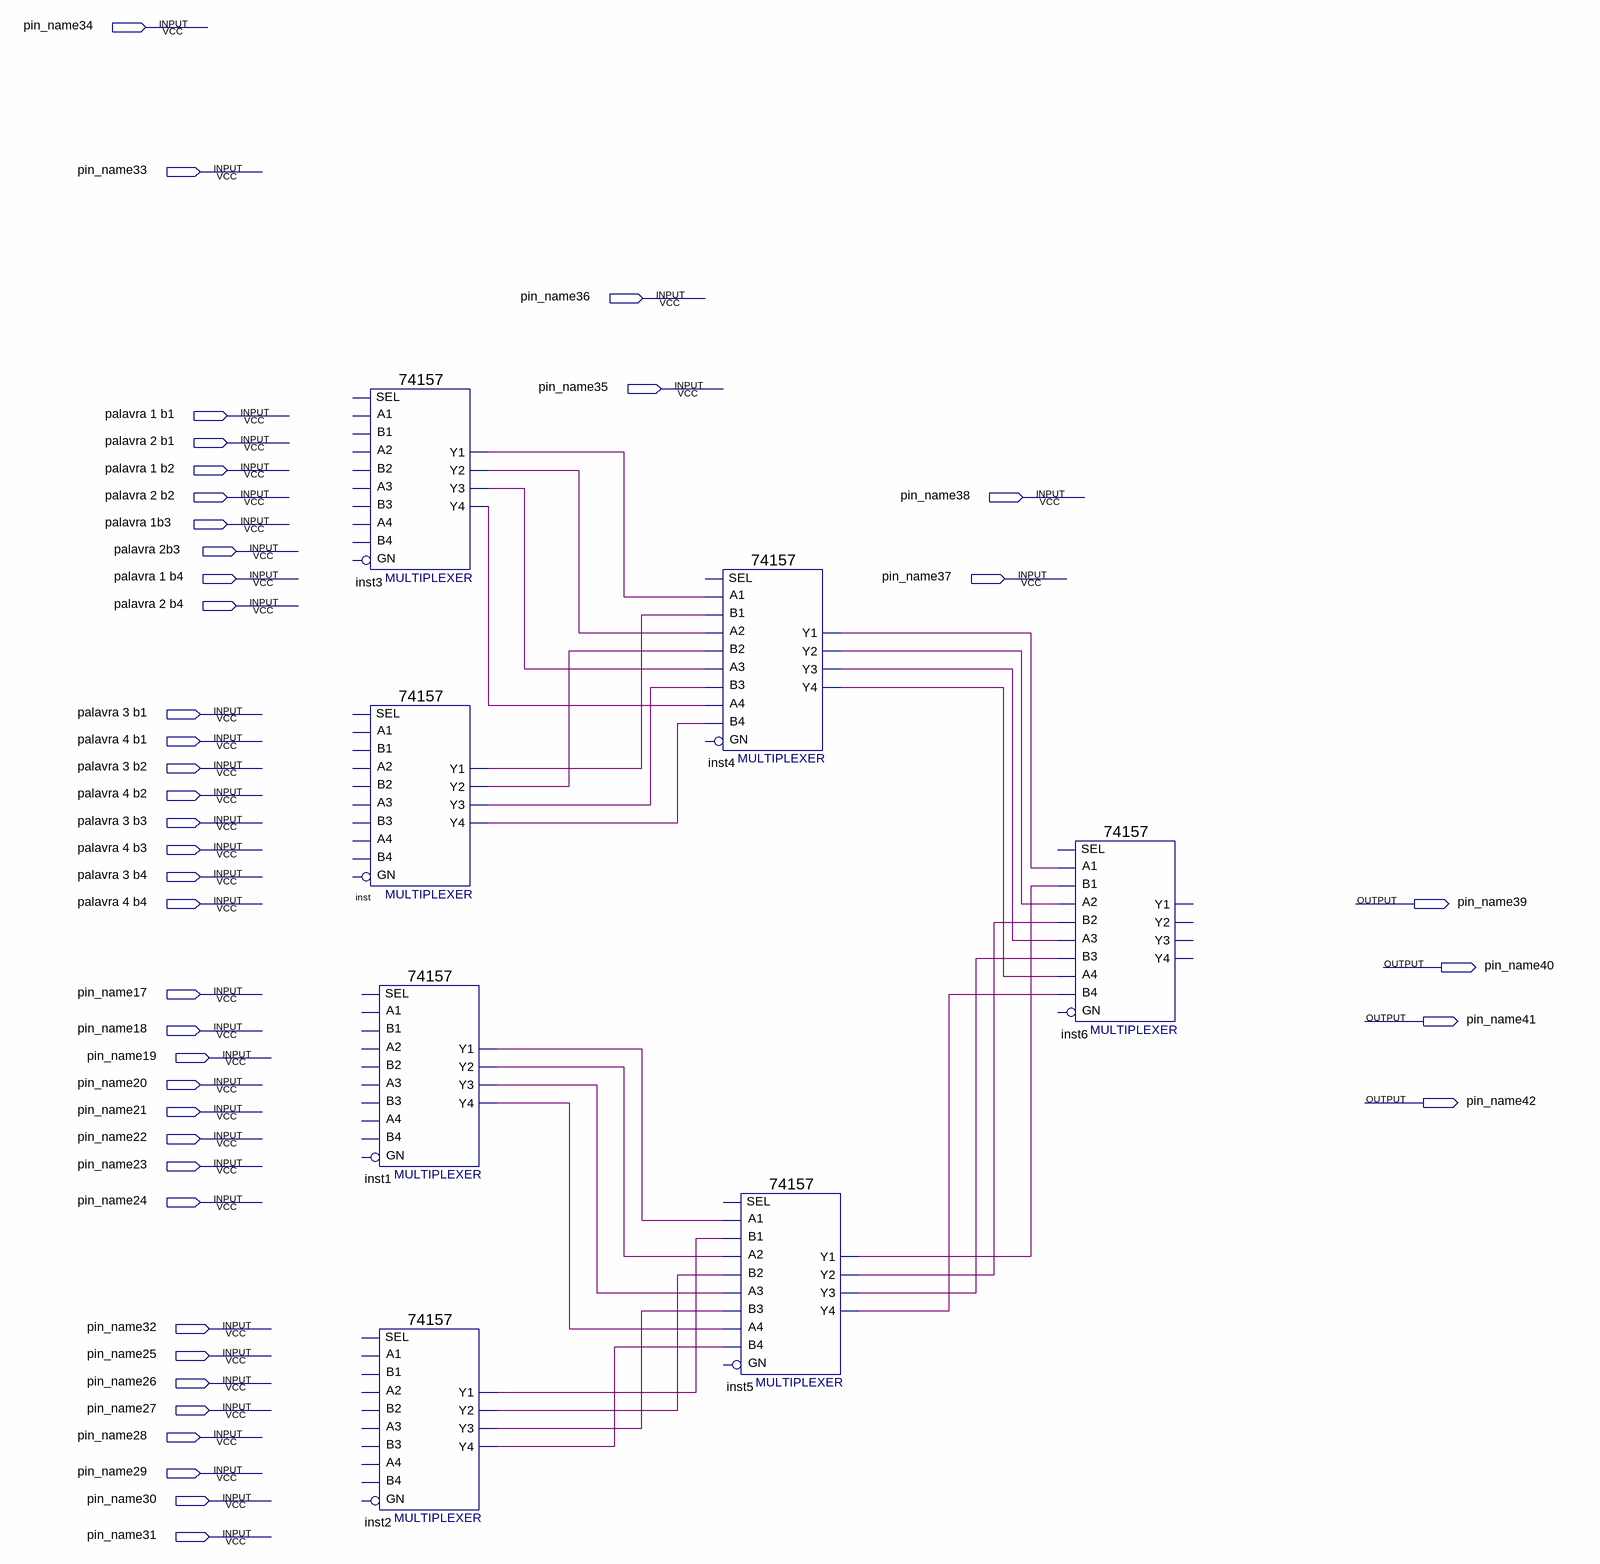
[diagram p0: schematic sheet]
// Quartus schematic Block2.bdf as structural Verilog: 7 symbols, 42 pins
module Block2 (
  input  pin_name34,
  input  pin_name33,
  input  pin_name36,
  input  pin_name35,
  input  \palavra_1_b1 ,
  input  \palavra_2_b1 ,
  input  \palavra_1_b2 ,
  input  \palavra_2_b2 ,
  input  pin_name38,
  input  \palavra_1b3 ,
  input  \palavra_2b3 ,
  input  \palavra_1_b4 ,
  input  pin_name37,
  input  \palavra_2_b4 ,
  input  \palavra_3_b1 ,
  input  \palavra_4_b1 ,
  input  \palavra_3_b2 ,
  input  \palavra_4_b2 ,
  input  \palavra_3_b3 ,
  input  \palavra_4_b3 ,
  input  \palavra_3_b4 ,
  input  \palavra_4_b4 ,
  input  pin_name17,
  input  pin_name18,
  input  pin_name19,
  input  pin_name20,
  input  pin_name21,
  input  pin_name22,
  input  pin_name23,
  input  pin_name24,
  input  pin_name32,
  input  pin_name25,
  input  pin_name26,
  input  pin_name27,
  input  pin_name28,
  input  pin_name29,
  input  pin_name30,
  input  pin_name31,
  output pin_name39,
  output pin_name40,
  output pin_name41,
  output pin_name42
);

  wire inst1_y1, inst1_y2, inst1_y3, inst1_y4, inst2_y1, inst2_y2, inst2_y3, inst2_y4, inst3_y1, inst3_y2,
       inst3_y3, inst3_y4, inst4_y1, inst4_y2, inst4_y3, inst4_y4, inst5_y1, inst5_y2, inst5_y3, inst5_y4,
       inst_y1, inst_y2, inst_y3, inst_y4;

  \74157  inst3 (
    .Y2(inst3_y2), .Y1(inst3_y1), .Y4(inst3_y4), .Y3(inst3_y3));  // open: A1, B1, SEL, B2, A3, B3, A2, B4, GN, A4
  \74157  inst (
    .Y2(inst_y2), .Y1(inst_y1), .Y4(inst_y4), .Y3(inst_y3));  // open: A1, B1, SEL, B2, A3, B3, A2, B4, GN, A4
  \74157  inst1 (
    .Y2(inst1_y2), .Y1(inst1_y1), .Y4(inst1_y4), .Y3(inst1_y3));  // open: A1, B1, SEL, B2, A3, B3, A2, B4, GN, A4
  \74157  inst2 (
    .Y2(inst2_y2), .Y1(inst2_y1), .Y4(inst2_y4), .Y3(inst2_y3));  // open: A1, B1, SEL, B2, A3, B3, A2, B4, GN, A4
  \74157  inst4 (
    .A1(inst3_y1), .B1(inst_y1), .B2(inst_y2), .A3(inst3_y3), .B3(inst_y3), .A2(inst3_y2), .B4(inst_y4),
    .A4(inst3_y4), .Y2(inst4_y2), .Y1(inst4_y1), .Y4(inst4_y4), .Y3(inst4_y3));  // open: SEL, GN
  \74157  inst5 (
    .A1(inst1_y1), .B1(inst2_y1), .B2(inst2_y2), .A3(inst1_y3), .B3(inst2_y3), .A2(inst1_y2), .B4(inst2_y4),
    .A4(inst1_y4), .Y2(inst5_y2), .Y1(inst5_y1), .Y4(inst5_y4), .Y3(inst5_y3));  // open: SEL, GN
  \74157  inst6 (
    .A1(inst4_y1), .B1(inst5_y1), .B2(inst5_y2), .A3(inst4_y3), .B3(inst5_y3), .A2(inst4_y2), .B4(inst5_y4),
    .A4(inst4_y4));  // open: SEL, GN, Y2, Y1, Y4, Y3
endmodule
